# Altium schematic sheet P05_MPU4.SchDoc
size A
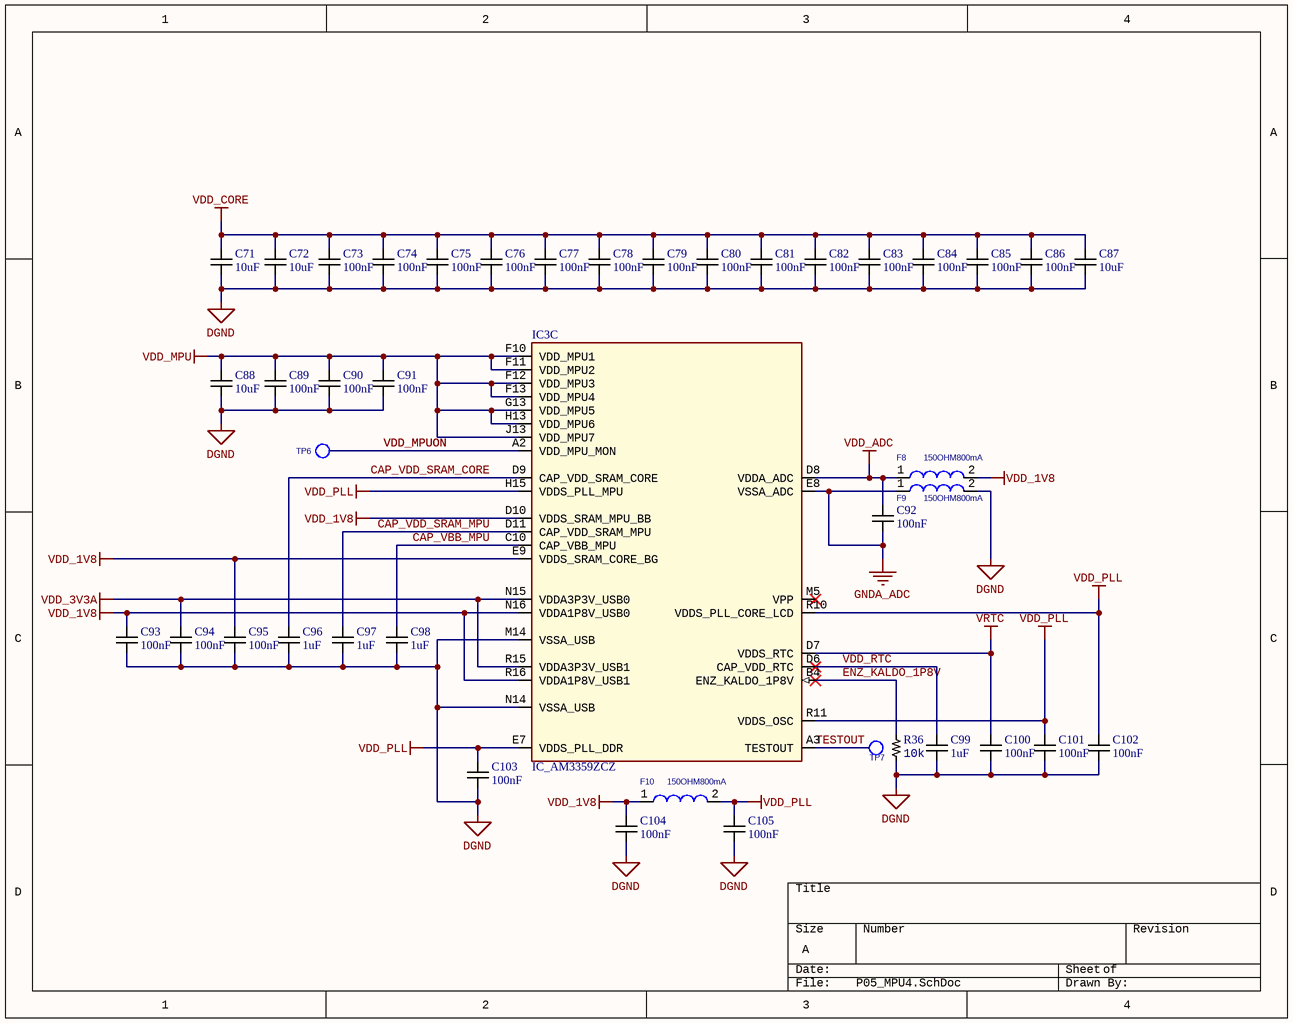
[diagram p0: P05_MPU4.SchDoc]

## Parts
C71  Capacitance: 10uF  [CAP0805]  (hidden comment: C2012X6S1A106K085AC)
C72  Capacitance: 10uF  [CAP0805]  (hidden comment: C2012X6S1A106K085AC)
C73  Capacitance: 100nF  [CAP0402]  (hidden comment: C0402C104K4RACTU)
C74  Capacitance: 100nF  [CAP0402]  (hidden comment: C0402C104K4RACTU)
C75  Capacitance: 100nF  [CAP0402]  (hidden comment: C0402C104K4RACTU)
C76  Capacitance: 100nF  [CAP0402]  (hidden comment: C0402C104K4RACTU)
C77  Capacitance: 100nF  [CAP0402]  (hidden comment: C0402C104K4RACTU)
C78  Capacitance: 100nF  [CAP0402]  (hidden comment: C0402C104K4RACTU)
C79  Capacitance: 100nF  [CAP0402]  (hidden comment: C0402C104K4RACTU)
C80  Capacitance: 100nF  [CAP0402]  (hidden comment: C0402C104K4RACTU)
C81  Capacitance: 100nF  [CAP0402]  (hidden comment: C0402C104K4RACTU)
C82  Capacitance: 100nF  [CAP0402]  (hidden comment: C0402C104K4RACTU)
C83  Capacitance: 100nF  [CAP0402]  (hidden comment: C0402C104K4RACTU)
C84  Capacitance: 100nF  [CAP0402]  (hidden comment: C0402C104K4RACTU)
C85  Capacitance: 100nF  [CAP0402]  (hidden comment: C0402C104K4RACTU)
C86  Capacitance: 100nF  [CAP0402]  (hidden comment: C0402C104K4RACTU)
C87  Capacitance: 10uF  [CAP0805]  (hidden comment: C2012X6S1A106K085AC)
C88  Capacitance: 10uF  [CAP0805]  (hidden comment: C2012X6S1A106K085AC)
C89  Capacitance: 100nF  [CAP0402]  (hidden comment: C0402C104K4RACTU)
C90  Capacitance: 100nF  [CAP0402]  (hidden comment: C0402C104K4RACTU)
C91  Capacitance: 100nF  [CAP0402]  (hidden comment: C0402C104K4RACTU)
C92  Capacitance: 100nF  [CAP0402]  (hidden comment: C0402C104K4RACTU)
C93  Capacitance: 100nF  [CAP0402]  (hidden comment: C0402C104K4RACTU)
C94  Capacitance: 100nF  [CAP0402]  (hidden comment: C0402C104K4RACTU)
C95  Capacitance: 100nF  [CAP0402]  (hidden comment: C0402C104K4RACTU)
C96  Capacitance: 1uF  [CAP0402]  (hidden comment: CC0402KRX5R6BB105)
C97  Capacitance: 1uF  [CAP0402]  (hidden comment: CC0402KRX5R6BB105)
C98  Capacitance: 1uF  [CAP0402]  (hidden comment: CC0402KRX5R6BB105)
C99  Capacitance: 1uF  [CAP0402]  (hidden comment: CC0402KRX5R6BB105)
C100  Capacitance: 100nF  [CAP0402]  (hidden comment: C0402C104K4RACTU)
C101  Capacitance: 100nF  [CAP0402]  (hidden comment: C0402C104K4RACTU)
C102  Capacitance: 100nF  [CAP0402]  (hidden comment: C0402C104K4RACTU)
C103  Capacitance: 100nF  [CAP0402]  (hidden comment: C0402C104K4RACTU)
C104  Capacitance: 100nF  [CAP0402]  (hidden comment: C0402C104K4RACTU)
C105  Capacitance: 100nF  [CAP0402]  (hidden comment: C0402C104K4RACTU)
F8  150OHM800mA  [FB0805]
F9  150OHM800mA  [FB0805]
F10  150OHM800mA  [FB0805]
IC3  IC_AM3359ZCZ  [BGA-324]  (part C of 7)
R36  Resistance: 10k  [RES0402]  (hidden comment: RC0402FR-0710KL)
TP6  TESTPT1  [tp1-8040]  (value not drawn)  (no BOM)
TP7  TESTPT1  [tp1-8040]  (value not drawn)  (no BOM)

## Nets
DGND: C71.1 C72.1 C73.2 C74.2 C75.2 C76.2 C77.2 C78.2 C79.2 C80.2 C81.2 C82.2 C83.2 C84.2 C85.2 C86.2 C87.1 C88.1 C89.2 C90.2 C91.2 C93.2 C94.2 C95.2 C96.2 C97.2 C98.2 C99.2 C100.2 C101.2 C102.2 C103.2 C104.2 C105.2 F9.2 IC3.M14(VSSA_USB) IC3.N14(VSSA_USB) R36.2
GNDA_ADC: C92.2 F9.1 IC3.E8(VSSA_ADC)
VDD_1V8: C93.1 C95.1 C104.1 F8.2 F10.1 IC3.D10(VDDS_SRAM_MPU_BB) IC3.E9(VDDS_SRAM_CORE_BG) IC3.N16(VDDA1P8V_USB0) IC3.R16(VDDA1P8V_USB1)
VDD_3V3A: C94.1 IC3.N15(VDDA3P3V_USB0) IC3.R15(VDDA3P3V_USB1)
VDD_ADC: C92.1 F8.1 IC3.D8(VDDA_ADC)
VDD_CORE: C71.2 C72.2 C73.1 C74.1 C75.1 C76.1 C77.1 C78.1 C79.1 C80.1 C81.1 C82.1 C83.1 C84.1 C85.1 C86.1 C87.2
VDD_MPU: C88.2 C89.1 C90.1 C91.1 IC3.F10(VDD_MPU1) IC3.F11(VDD_MPU2) IC3.F12(VDD_MPU3) IC3.F13(VDD_MPU4) IC3.G13(VDD_MPU5) IC3.H13(VDD_MPU6) IC3.J13(VDD_MPU7)
VDD_PLL: C101.1 C102.1 C103.1 C105.1 F10.2 IC3.E7(VDDS_PLL_DDR) IC3.H15(VDDS_PLL_MPU) IC3.R10(VDDS_PLL_CORE_LCD) IC3.R11(VDDS_OSC)
VRTC: C100.1 IC3.D7(VDDS_RTC)
CAP_VBB_MPU: C98.1 IC3.C10(CAP_VBB_MPU)
CAP_VDD_SRAM_CORE: C96.1 IC3.D9(CAP_VDD_SRAM_CORE)
CAP_VDD_SRAM_MPU: C97.1 IC3.D11(CAP_VDD_SRAM_MPU)
ENZ_KALDO_1P8V: IC3.B4(ENZ_KALDO_1P8V) R36.1
TESTOUT: IC3.A3(TESTOUT) TP7.1(TP)
VDD_MPUON: IC3.A2(VDD_MPU_MON) TP6.1(TP)
VDD_RTC: C99.1 IC3.D6(CAP_VDD_RTC)

Not connected (* = marked no-connect by the designer): IC3 M5(VPP)*

## Library data of the parts
C71 C72 C87 C88 = CAP_10uF: MLCC 10uF 0805 SMD; Manufacturer: TDK; Tolerance: 10%; Dielectric Material: Ceramic; Voltage Rating: 10V; Dielectric: X6S; Supplier 1: Digi-Key; Supplier Part Number 1: 445-7613-1-ND; Manufacturer Part Number: C2012X6S1A106K085AC; RoHS: Yes; Stock 1: 46852; Pricing 1: 1=0.30000, 10=0.20500, 100=0.11610, 500=0.08198, 1000=0.07173 (USD); Packaging: Tape and Reel; Mount: Surface Mount; Case/Package: 0805; Weight: 0.000194oz; Case Code (Metric): 2012; Case Code (Imperial): 0805; Min Operating Temperature: -55°C; Max Operating Temperature: 105°C; Termination: SMD/SMT; Package Quantity: 4000; Voltage Rating (DC): 10V; Composition: Ceramic; Length: 2mm; Height: 1.25mm; Depth: 1.25mm; Width: 0.049inch; Thickness: 0.037inch; REACH SVHC: No SVHC; Lead Free: Lead Free; ComponentLink3URL: https://datasheet.ciiva.com/6290/tdkmlcccaprange-6290501.pdf?src-supplier=Digi-Key; ComponentLink3Description: Datasheet
C73-C86 C89-C95 C100-C105 = CAP_100nF: MLCC 100nF 0402 SMD; Manufacturer: KEMET; Tolerance: 10%; Voltage Rating (DC): 16V; Dielectric: X7R; Dissipation Factor: 3.5%; Supplier 1: Digi-Key; Supplier Part Number 1: 399-3521-1-ND; Manufacturer Part Number: C0402C104K4RACTU; RoHS: Yes; Stock 1: 6512243; Pricing 1: 1=0.10000, 10=0.04200, 100=0.01860, 500=0.01328, 1000=0.01044, 2500=0.00949, 5000=0.00873 (USD); Packaging: Tape and Reel; Mount: Surface Mount; Case/Package: 0402; Case Code (Imperial): 0402; Case Code (Metric): 1005; Contact Plating: Tin,Matte; Min Operating Temperature: -55°C; Max Operating Temperature: 125°C; Package Quantity: 10000; Voltage Rating: 16V; Termination: SMD/SMT; Length: 1mm; Height: 0.5mm; Width: 0.5mm; Depth: 0.5mm; Radiation Hardening: No; ComponentLink2URL: https://datasheet.ciiva.com/18192/getdatasheetpartid-385384-18192412.pdf?src-supplier=Verical; ComponentLink2Description: Datasheet
C96-C99 = CAP_1uF: MLCC 1uF 0402 SMD; Manufacturer: Yageo; Tolerance: 10%; Dielectric: X5R; Voltage Rating: 10V; Dissipation Factor: 15%; Supplier 1: Digi-Key; Manufacturer Part Number: CC0402KRX5R6BB105; RoHS: Yes; Stock 1: 6411796; Pricing 1: 1=0.10000, 10=0.06300, 100=0.02790, 500=0.01996, 1000=0.01568, 2500=0.01425, 5000=0.01311 (USD); Packaging: Tape and Reel; ComponentLink1URL: https://datasheet.ciiva.com/176/upy-gphc-x5r-4v-to-50v-12-176704.pdf?src-supplier=Digi-Key; ComponentLink1Description: https://datasheet.ciiva.com/176/upy-gphc-x5r-4v-to-50v-12-176704.pdf?src-supplier=Digi-Key; Mount: Surface Mount; Case/Package: 0402; Number of Pins: 2; Case Code (Metric): 1005; Case Code (Imperial): 0402; Min Operating Temperature: -55°C; Max Operating Temperature: 85°C; Package Quantity: 1; Voltage Rating (DC): 10V; Termination: SMD/SMT; Composition: Ceramic; Length: 1mm; Height: 0.5mm; Width: 0.02inch; Thickness: 0.022inch; Depth: 0.5mm; Radiation Hardening: No; REACH SVHC: No SVHC; Lead Free: Lead Free; Halogen Free: Halogen Free; ComponentLink2URL: https://datasheet.ciiva.com/176/mlccorderingcode-176706.pdf?src-supplier=Digi-Key; ComponentLink2Description: https://datasheet.ciiva.com/176/mlccorderingcode-176706.pdf?src-supplier=Digi-Key; ComponentLink3URL: https://datasheet.ciiva.com/176/mlccorderingcode-176705.pdf?src-supplier=Digi-Key; ComponentLink3Description: https://datasheet.ciiva.com/176/mlccorderingcode-176705.pdf?src-supplier=Digi-Key
F8-F10 = FERR: FERRITE 800MA 150 OHM 0805 SMD; PartName: FerriteBead150ohm800mA; Mfr: Steward; MfrNum: LI0805H151R-10; TIIntPartnumber: 1L0010; Manufacturer: Laird-Signal Integrity Products; Vendor: Digikey; Impedance @ Frequency: 150 Ohm @ 100MHz; DC Resistance (DCR): 150 mOhm Max; Filter Type: Differential Mode - Single; Supplier 1: Digi-Key; Supplier Part Number 1: 240-2384-6-ND; Manufacturer Part Number: LI0805H151R-10; RoHS: RoHS Compliant; Category: Filters; Stock 1: 3694; Pricing 1: 1=0.1, 10=0.07, 25=0.064, 50=0.0574, 100=0.0421, 250=0.03064, 500=0.02808, 1000=0.02424 (USD); Current Rating: 800mA; Package / Case: 0805 (2012 Metric); Mounting Type: Surface Mount; Packaging: Digi-Reel®; Height (Max): 0.043" (1.10mm); Size / Dimension: 0.079" L x 0.049" W (2.00mm x 1.25mm); ComponentLink1URL: http://www.lairdtech.com/WorkArea/linkit.aspx?LinkIdentifier=id&ItemID=4912; ComponentLink1Description: http://www.lairdtech.com/WorkArea/linkit.aspx?LinkIdentifier=id&ItemID=4912
IC3 = IC_AM335X_ZCE_1: SubArctic Cortex A8 Processor 18x18; Manufacturer: Texas Instruments; Manufacturer Part Number: XAM3359ZCZ; Processor Type: ARM Microprocessor; Voltage: 1.06 V ~ 1.15 V; Supplier 1: Digi-Key; Supplier Part Number 1: 296-35073-ND; RoHS: RoHS Compliant; Category: Integrated Circuits (ICs); Stock 1: 16; Pricing 1: 1=33.5, 10=30.988, 100=26.465, 250=24.28752, 500=23.115, 1000=21.775, 2500=21.105, 5000=20.6025, 10000=20.1 (USD); Features: -; Speed: -; Mounting Type: Surface Mount; Package / Case: 324-LFBGA; Supplier Device Package: 324-NFBGA(15x15); Packaging: Tray; ComponentLink1URL: http://www.ti.com/lit/ds/symlink/am3354.pdf; ComponentLink1Description: http://www.ti.com/lit/ds/symlink/am3354.pdf
R36 = RES_10k: Resistor 10kOhm 0402 SMD; Manufacturer: Yageo; Temperature Coefficient: 100ppm/°C; Tolerance: 1%; Voltage Rating (DC): 50V; Power Rating: 62.5mW; Supplier 1: Digi-Key; Manufacturer Part Number: RC0402FR-0710KL; RoHS: Yes; Stock 1: 72891652; Pricing 1: 1=0.10000, 10=0.01500, 100=0.00600, 1000=0.00270, 2500=0.00235, 5000=0.00194 (USD); Composition: Thick Film; Height: 0.32mm; Number of Terminations: 2; Packaging: Tape and Reel; ComponentLink1URL: https://datasheet.ciiva.com/7660/38568-7660787.pdf?src-supplier=Element14; ComponentLink1Description: https://datasheet.ciiva.com/7660/38568-7660787.pdf?src-supplier=Element14; Case/Package: 0402; Number of Pins: 2; Case Code (Imperial): 0402; Case Code (Metric): 1005; Min Operating Temperature: -55°C; Max Operating Temperature: 155°C; Voltage Rating: 50V; Termination: SMD/SMT; Military Standard: Not; Working Voltage: 50V; Length: 1mm; Width: 0.5mm; Depth: 0.5mm; Lead Pitch: 0.2mm; REACH SVHC: No SVHC; Lead Free: Lead Free; ComponentLink2URL: https://datasheet.ciiva.com/7983/1018594-7983486.pdf?src-supplier=Element14; ComponentLink2Description: https://datasheet.ciiva.com/7983/1018594-7983486.pdf?src-supplier=Element14; ComponentLink3URL: https://datasheet.ciiva.com/7849/1784430-7849813.pdf?src-supplier=Element14; ComponentLink3Description: https://datasheet.ciiva.com/7849/1784430-7849813.pdf?src-supplier=Element14; ComponentLink4URL: https://datasheet.ciiva.com/7849/1686128-7849814.pdf?src-supplier=Element14; ComponentLink4Description: https://datasheet.ciiva.com/7849/1686128-7849814.pdf?src-supplier=Element14; ComponentLink5URL: https://datasheet.ciiva.com/7849/1784430-7849815.pdf?src-supplier=Element14; ComponentLink5Description: https://datasheet.ciiva.com/7849/1784430-7849815.pdf?src-supplier=Element14; ComponentLink6URL: https://datasheet.ciiva.com/22747/1018594-22747512.pdf?src-supplier=Element14; ComponentLink6Description: https://datasheet.ciiva.com/22747/1018594-22747512.pdf?src-supplier=Element14; ComponentLink7URL: https://datasheet.ciiva.com/12667/pyu-rc0402-51-rohs-l-6-r-12667067.pdf?src-supplier=Mouser; ComponentLink7Description: https://datasheet.ciiva.com/12667/pyu-rc0402-51-rohs-l-6-r-12667067.pdf?src-supplier=Mouser